# Altium project motor_control_board.PrjPcb
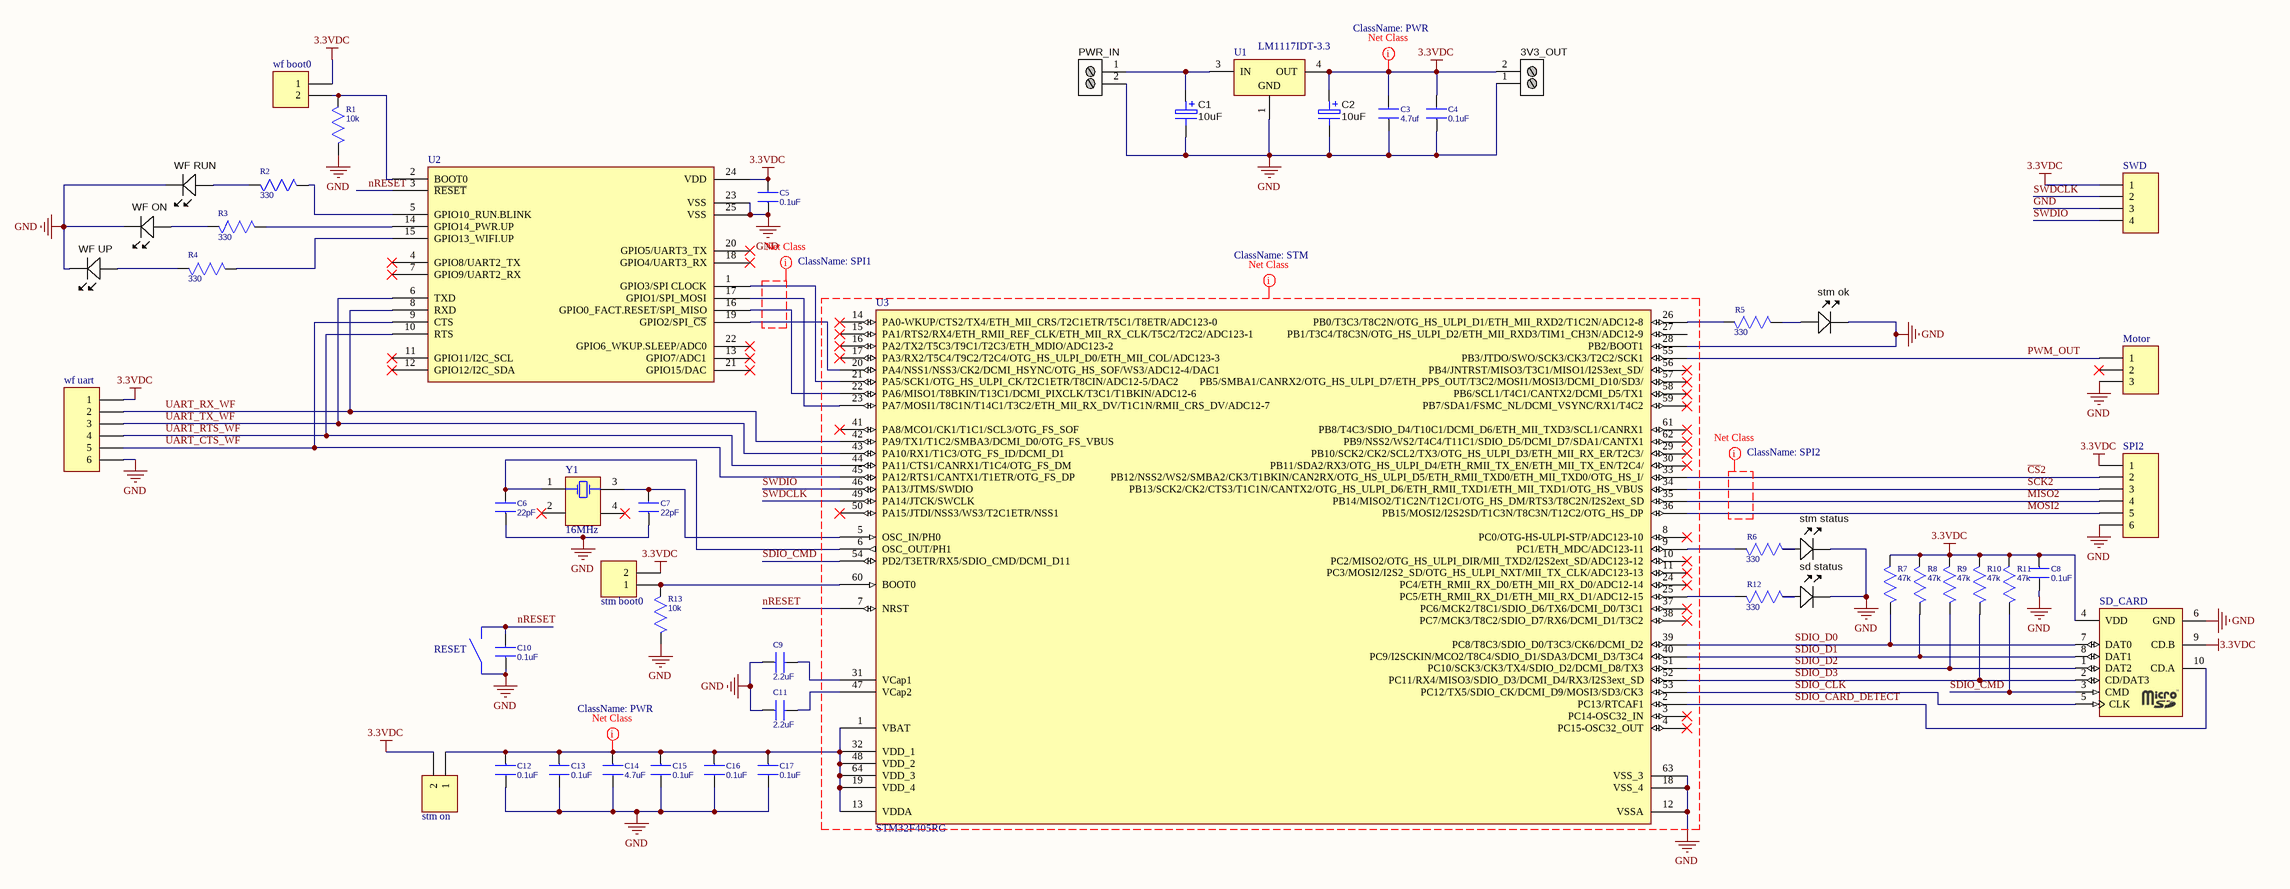
[diagram p0: stm_intf_motor.SchDoc]
1 sheet, 51 parts. Net scope: global (net labels, ports and power ports of the same name join across sheets).
Board file: stm_intf_motor.PcbDoc

## Sheet stm_intf_motor.SchDoc
size A2

### Parts
3V3_OUT  Stackable ScrewTerm  [2P_PCB_ScrewTerm_90S_3.81MM]  (value not drawn)
C1  10uF  [CAPMP3216X180N]
C2  10uF  [CAPMP3216X180N]
C3  4.7uf  [C_1206]
C4  0.1uF  [C_1206]
C5  0.1uF  [C_1206]
C6  22pF  [C_1206]
C7  22pF  [C_1206]
C8  0.1uF  [C_1206]
C9  2.2uF  [C_1206]
C10  0.1uF  [C_1206]
C11  2.2uF  [C_1206]
C12  0.1uF  [C_1206]
C13  0.1uF  [C_1206]
C14  4.7uF  [C_1206]
C15  0.1uF  [C_1206]
C16  0.1uF  [C_1206]
C17  0.1uF  [C_1206]
Motor  PLS-3  [PLS-3-3D]  (value not drawn)
PWR_IN  Stackable ScrewTerm  [2P_PCB_ScrewTerm_90S_3.81MM]  (value not drawn)
R1  10k  [R_1206]
R2  330  [R_1206]
R3  330  [R_1206]
R4  330  [R_1206]
R5  330  [R_1206]
R6  330  [R_1206]
R7  47k  [R_1206]
R8  47k  [R_1206]
R9  47k  [R_1206]
R10  47k  [R_1206]
R11  47k  [R_1206]
R12  330  [R_1206]
R13  10k  [R_1206]
RESET  Reset  [LTL613]  (value not drawn)
SD_CARD  MICROSD  [DM3BT]  (value not drawn)
sd_status  (no value)  [LED-0805-K]
SPI2  PLS-6  [PLS-6-3D]  (value not drawn)
stm_boot0  PLS2-2  [PLS-2-2]  (value not drawn)
stm_ok  (no value)  [LED-0805-K]
stm_on  PLS2-2  [PLS-2-2]  (value not drawn)
stm_status  (no value)  [LED-0805-K]
SWD  PLS-4  [PLS-4-3D]  (value not drawn)
U1  LM1117IDT-3.3  [TD03B_N]
U2  SPWF01  [CAC-152P2158X1524-24N]  (value not drawn)
U3  STM32F405RG  [LQFP64]
wf_boot0  PLS2-2  [PLS-2-2]  (value not drawn)
WF_ON  (no value)  [LED-0805-K]
WF_RUN  (no value)  [LED-0805-K]
wf_uart  PLS-6  [PLS-6-3D]  (value not drawn)
WF_UP  (no value)  [LED-0805-K]
Y1  16MHz  [05H32]

### Nets
3.3VDC: 3V3_OUT.2 C2.1 C3.1 C4.1 C5.1 C8.2 R7.1 R8.1 R9.1 R10.1 R11.1 SD_CARD.4(VDD) SD_CARD.9(CD.B) SPI2.1 stm_boot0.2 stm_on.2 SWD.1 U1.4(OUT) U2.24(VDD) wf_boot0.1 wf_uart.1
GND: 3V3_OUT.1 C1.2 C2.2 C3.2 C4.2 C5.2 C6.2 C7.2 C8.1 C9.2 C10.2 C11.2 C12.1 C13.1 C14.1 C15.1 C16.1 C17.1 Motor.3 PWR_IN.2 R1.2 R13.2 RESET.0 SD_CARD.6(GND) sd_status.K SPI2.6 stm_ok.K stm_status.K SWD.3 U1.1(GND) U2.23(VSS) U2.25(VSS) U3.12(VSSA) U3.18(VSS_4) U3.28(PB2/BOOT1) U3.63(VSS_3) WF_ON.K WF_RUN.K wf_uart.6 WF_UP.K
~{CS}2: SPI2.2 U3.33(PB12/NSS2/WS2/SMBA2/CK3/T1BKIN/CAN2RX/OTG_HS_ULPI_D5/ETH_RMII_TXD0/ETH_MII_TXD0/OTG_HS_I/)
MISO2: SPI2.4 U3.35(PB14/MISO2/T1C2N/T12C1/OTG_HS_DM/RTS3/T8C2N/I2S2ext_SD)
MOSI2: SPI2.5 U3.36(PB15/MOSI2/I2S2SD/T1C3N/T8C3N/T12C2/OTG_HS_DP)
nRESET: C10.1 RESET.1 U2.3(~{RESET}) U3.7(NRST)
PWM_OUT: Motor.1 U3.55(PB3/JTDO/SWO/SCK3/CK3/T2C2/SCK1)
SCK2: SPI2.3 U3.34(PB13/SCK2/CK2/CTS3/T1C1N/CANTX2/OTG_HS_ULPI_D6/ETH_RMII_TXD1/ETH_MII_TXD1/OTG_HS_VBUS)
SDIO_CARD_DETECT: SD_CARD.10(CD.A) U3.2(PC13/RTCAF1)
SDIO_CLK: SD_CARD.5(CLK) U3.53(PC12/TX5/SDIO_CK/DCMI_D9/MOSI3/SD3/CK3)
SDIO_CMD: R11.2 SD_CARD.3(CMD) U3.54(PD2/T3ETR/RX5/SDIO_CMD/DCMI_D11)
SDIO_D0: R7.2 SD_CARD.7(DAT0) U3.39(PC8/T8C3/SDIO_D0/T3C3/CK6/DCMI_D2)
SDIO_D1: R8.2 SD_CARD.8(DAT1) U3.40(PC9/I2SCKIN/MCO2/T8C4/SDIO_D1/SDA3/DCMI_D3/T3C4)
SDIO_D2: R9.2 SD_CARD.1(DAT2) U3.51(PC10/SCK3/CK3/TX4/SDIO_D2/DCMI_D8/TX3)
SDIO_D3: R10.2 SD_CARD.2(CD/DAT3) U3.52(PC11/RX4/MISO3/SDIO_D3/DCMI_D4/RX3/I2S3ext_SD)
SWDCLK: SWD.2 U3.49(PA14/JTCK/SWCLK)
SWDIO: SWD.4 U3.46(PA13/JTMS/SWDIO)
UART_CTS_WF: U2.9(CTS) U3.45(PA12/RTS1/CANTX1/T1ETR/OTG_FS_DP) wf_uart.5
UART_RTS_WF: U2.10(RTS) U3.44(PA11/CTS1/CANRX1/T1C4/OTG_FS_DM) wf_uart.4
UART_RX_WF: U2.8(RXD) U3.42(PA9/TX1/T1C2/SMBA3/DCMI_D0/OTG_FS_VBUS) wf_uart.2
UART_TX_WF: U2.6(TXD) U3.43(PA10/RX1/T1C3/OTG_FS_ID/DCMI_D1) wf_uart.3
NetC1_1: C1.1 PWR_IN.1 U1.3(IN)
NetC6_1: C6.1 U3.6(OSC_OUT/PH1) Y1.1(OSC1)
NetC7_1: C7.1 U3.5(OSC_IN/PH0) Y1.3(OSC2)
NetC9_1: C9.1 U3.31(VCap1)
NetC11_1: C11.1 U3.47(VCap2)
NetC12_2: C12.2 C13.2 C14.2 C15.2 C16.2 C17.2 stm_on.1 U3.1(VBAT) U3.13(VDDA) U3.19(VDD_4) U3.32(VDD_1) U3.48(VDD_2) U3.64(VDD_3)
NetR1_1: R1.1 U2.2(BOOT0) wf_boot0.2
NetR2_1: R2.1 U2.5(GPIO10_RUN.BLINK)
NetR2_2: R2.2 WF_RUN.A
NetR3_1: R3.1 U2.14(GPIO14_PWR.UP)
NetR3_2: R3.2 WF_ON.A
NetR4_1: R4.1 U2.15(GPIO13_WIFI.UP)
NetR4_2: R4.2 WF_UP.A
NetR5_1: R5.1 stm_ok.A
NetR5_2: R5.2 U3.26(PB0/T3C3/T8C2N/OTG_HS_ULPI_D1/ETH_MII_RXD2/T1C2N/ADC12-8)
NetR6_1: R6.1 stm_status.A
NetR6_2: R6.2 U3.9(PC1/ETH_MDC/ADC123-11)
NetR12_1: R12.1 sd_status.A
NetR12_2: R12.2 U3.25(PC5/ETH_RMII_RX_D1/ETH_MII_RX_D1/ADC12-15)
NetR13_1: R13.1 stm_boot0.1 U3.60(BOOT0)
NetU2_1: U2.1(GPIO3/SPI_CLOCK) U3.21(PA5/SCK1/OTG_HS_ULPI_CK/T2C1ETR/T8CIN/ADC12-5/DAC2)
NetU2_16: U2.16(GPIO0_FACT.RESET/SPI_MISO) U3.22(PA6/MISO1/T8BKIN/T13C1/DCMI_PIXCLK/T3C1/T1BKIN/ADC12-6)
NetU2_17: U2.17(GPIO1/SPI_MOSI) U3.23(PA7/MOSI1/T8C1N/T14C1/T3C2/ETH_MII_RX_DV/T1C1N/RMII_CRS_DV/ADC12-7)
NetU2_19: U2.19(GPIO2/SPI_~{CS}) U3.20(PA4/NSS1/NSS3/CK2/DCMI_HSYNC/OTG_HS_SOF/WS3/ADC12-4/DAC1)

Not connected (* = marked no-connect by the designer): Motor 2*; U2 4(GPIO8/UART2_TX)* 7(GPIO9/UART2_RX)* 11(GPIO11/I2C_SCL)* 12(GPIO12/I2C_SDA)* 13(GPIO7/ADC1)* 18(GPIO4/UART3_RX)* 20(GPIO5/UART3_TX)* 21(GPIO15/DAC)* 22(GPIO6_WKUP.SLEEP/ADC0)*; U3 3(PC14-OSC32_IN)* 4(PC15-OSC32_OUT)* 8(PC0/OTG-HS-ULPI-STP/ADC123-10)* 10(PC2/MISO2/OTG_HS_ULPI_DIR/MII_TXD2/I2S2ext_SD/ADC123-12)* 11(PC3/MOSI2/I2S2_SD/OTG_HS_ULPI_NXT/MII_TX_CLK/ADC123-13)* 14(PA0-WKUP/CTS2/TX4/ETH_MII_CRS/T2C1ETR/T5C1/T8ETR/ADC123-0)* 15(PA1/RTS2/RX4/ETH_RMII_REF_CLK/ETH_MII_RX_CLK/T5C2/T2C2/ADC123-1)* 16(PA2/TX2/T5C3/T9C1/T2C3/ETH_MDIO/ADC123-2)* 17(PA3/RX2/T5C4/T9C2/T2C4/OTG_HS_ULPI_D0/ETH_MII_COL/ADC123-3)* 24(PC4/ETH_RMII_RX_D0/ETH_MII_RX_D0/ADC12-14)* 27(PB1/T3C4/T8C3N/OTG_HS_ULPI_D2/ETH_MII_RXD3/TIM1_CH3N/ADC12-9) 29(PB10/SCK2/CK2/SCL2/TX3/OTG_HS_ULPI_D3/ETH_MII_RX_ER/T2C3/)* 30(PB11/SDA2/RX3/OTG_HS_ULPI_D4/ETH_RMII_TX_EN/ETH_MII_TX_EN/T2C4/)* 37(PC6/MCK2/T8C1/SDIO_D6/TX6/DCMI_D0/T3C1)* 38(PC7/MCK3/T8C2/SDIO_D7/RX6/DCMI_D1/T3C2)* 41(PA8/MCO1/CK1/T1C1/SCL3/OTG_FS_SOF)* 50(PA15/JTDI/NSS3/WS3/T2C1ETR/NSS1)* 56(PB4/JNTRST/MISO3/T3C1/MISO1/I2S3ext_SD/)* 57(PB5/SMBA1/CANRX2/OTG_HS_ULPI_D7/ETH_PPS_OUT/T3C2/MOSI1/MOSI3/DCMI_D10/SD3/)* 58(PB6/SCL1/T4C1/CANTX2/DCMI_D5/TX1)* 59(PB7/SDA1/FSMC_NL/DCMI_VSYNC/RX1/T4C2)* 61(PB8/T4C3/SDIO_D4/T10C1/DCMI_D6/ETH_MII_TXD3/SCL1/CANRX1)* 62(PB9/NSS2/WS2/T4C4/T11C1/SDIO_D5/DCMI_D7/SDA1/CANTX1)*; Y1 2(NC)* 4(NC)*

### Layout directives
net class PWR: 3.3VDC, NetC12_2
net class STM: GND
net class SPI1: (no net found under the mark)
net class SPI2: (no net found under the mark)

### Library data of the parts
3V3_OUT PWR_IN = 2P_ScrewTerm_90S_3.81MM: Terminal Block Screw Type THT 2-Position 3.81mm pitch; Manufacturer 1: Tyco Electronics; Manufacturer Part Number 1: 1776113-2; Value: 2 position; Pitch: 0.150" (3.81mm); Positions Per Level: 2; SCDType: undef; Package / Case: Side Entry; 3.81mm pitch; Category: Connectors Interconnects; Color: Black; Supplier 1: Digi-Key; Supplier Part Number 1: A97976-ND
C1 C2 = CAP_TANT_TYPE_A: Capacitor SMD Tantalum 4.7uF 10% 16V 3216-18; Manufacturer 1: Vishay/Sprague; Manufacturer Part Number 1: 293D475X9016A2TE3; SCDType: undef; Package / Case: EIA 535BAAC size A; Ratings: 16V; Tolerance: ±10%; Material: Tantalum; Supplier 1: Digi-Key; Supplier Part Number 1: 718-1148-1-ND
C3 C4 C6 C7 = C1206: Capacitor
  C3: Value: 4.7uf
  C4: Value: 0.1uF
  C6 C7: Value: 22pF
C5 C8-C17 = CAP_SMD_1206: Capacitor
  C5 C8 C10 C12 C13 C15-C17: Value: 0.1uF
  C9 C11: Value: 2.2uF
  C14: Value: 4.7uF
Motor = PLS-3: Header, 3-Pin; LatestRevisionDate: 17-Jul-2002; LatestRevisionNote: Re-released for DXP Platform.; Publisher: Altium Limited
R1-R13 = R1206: Resistor
  R1 R13: Value: 10k
  R2-R6 R12: Value: 330
  R7-R11: Value: 47k
RESET = Button_tact: Tact button switch
SD_CARD = MICROSD: Micro SD connector DM3AT-SF-PEJM5
sd_status stm_ok stm_status WF_ON WF_RUN WF_UP = LED_SMD_Green_0805_6mcd: LED, 0805 SMD, Green; Manufacturer 1: LITE-ON; Manufacturer Part Number 1: LTST-C171GKT; Ratings: 6 mcd; 569 nm; SCDType: source; Package / Case: 0805; Material: GaP; Supplier 1: Digi-Key; Supplier Part Number 1: 160-1423-1-ND; Value: =Color
SPI2 wf_uart = PLS-6: Header, 6-Pin; LatestRevisionDate: 17-Jul-2002; LatestRevisionNote: Re-released for DXP Platform.; Publisher: Altium Limited
stm_boot0 stm_on wf_boot0 = PLS2-2: Header, 2-Pin; LatestRevisionDate: 17-Jul-2002; LatestRevisionNote: Re-released for DXP Platform.; Publisher: Altium Limited
SWD = PLS-4: Header, 4-Pin; LatestRevisionDate: 17-Jul-2002; LatestRevisionNote: Re-released for DXP Platform.; Publisher: Altium Limited
U1 = LM1117IDT-3.3: 800mA Low-Dropout Linear Regulator; Manufacturer: National Semiconductor; CompType: LDO IC; PackageTopMarking: NSUZXYTT*LM1117*IDT-3.3; PowerWise: N; Published: 4-Dec-2008; DatasheetVersion: Apr-2006; PackageVersion: revC, Apr-2003; PackageReference: TD03B; Publisher: Altium Limited; PackageDescription: TO252, Molded, Jedec, 6.8 x 6.10 x 2.30mm Body, 3 Lead, 2.28mm Pitch, Surface Mount; PartNumber: LM1117IDT-3.3; RoHS: O; PinCount: 3; DigiKeyPartNumber: LM1117IDT-3.3-ND; Code_JEDEC: TO-252-AA; ComponentLink1Description: LM1117 Datasheet; ComponentLink1URL: http://www.national.com/ds/LM/LM1117.pdf; ComponentLink2Description: LM1117 Web Page; ComponentLink2URL: http://www.national.com/pf/LM/LM1117.html; ComponentLink3Description: TD03B Package Page; ComponentLink3URL: http://www.national.com/packaging/folders/td03b.html
U2 = SPWF01: UART-WIFI module
U3 = STM32F415RG: ST ARM MC; Published: 30-May-2008; DatasheetVersion: rev6, Mar-2008; PackageVersion: Mar-2008; PackageReference: LQFP64; Publisher: Altium Limited; PackageDescription: 64-Pin Low-Profile Quad Flat Pack, 10 x 10 mm Body, 0.5 mm Pitch (LQFP64); ComponentLink1Description: Manufacturer Link; ComponentLink1URL: www.st.com/stm32; ComponentLink2Description: Datasheet; ComponentLink2URL: http://www.st.com/stonline/products/literature/ds/13586.pdf
Y1 = Y_H53: Quartz Generator; Value: 50MHz